# Altium schematic sheet Sheet1 (1).SchDoc
size A
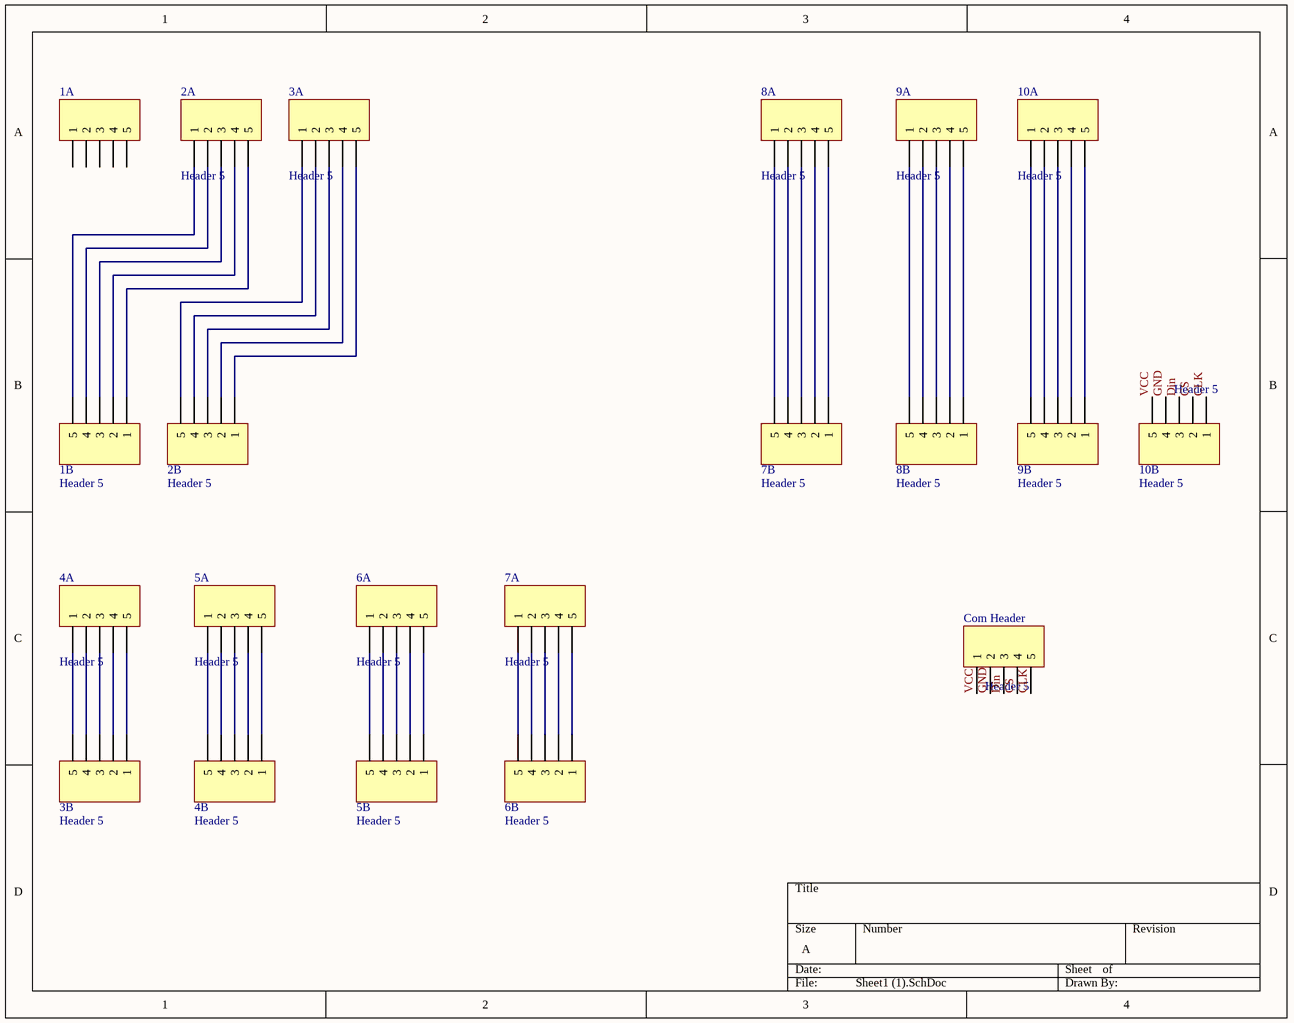
[diagram p0: Sheet1 (1).SchDoc]

## Parts
1A  Header 5  [HDR1X5]
1B  Header 5  [HDR1X5]
2A  Header 5  [HDR1X5]
2B  Header 5  [HDR1X5]
3A  Header 5  [HDR1X5]
3B  Header 5  [HDR1X5]
4A  Header 5  [HDR1X5]
4B  Header 5  [HDR1X5]
5A  Header 5  [HDR1X5]
5B  Header 5  [HDR1X5]
6A  Header 5  [HDR1X5]
6B  Header 5  [HDR1X5]
7A  Header 5  [HDR1X5]
7B  Header 5  [HDR1X5]
8A  Header 5  [HDR1X5]
8B  Header 5  [HDR1X5]
9A  Header 5  [HDR1X5]
9B  Header 5  [HDR1X5]
10A  Header 5  [HDR1X5]
10B  Header 5  [HDR1X5]
Com_Header  Header 5  [HDR1X5]

## Nets
CLK: 10B.1 Com_Header.5
CS: 10B.2 Com_Header.4
Din: 10B.3 Com_Header.3
GND: 10B.4 Com_Header.2
VCC: 10B.5 Com_Header.1
Net1B_1: 1B.1 2A.5
Net1B_2: 1B.2 2A.4
Net1B_3: 1B.3 2A.3
Net1B_4: 1B.4 2A.2
Net1B_5: 1B.5 2A.1
Net2B_1: 2B.1 3A.5
Net2B_2: 2B.2 3A.4
Net2B_3: 2B.3 3A.3
Net2B_4: 2B.4 3A.2
Net2B_5: 2B.5 3A.1
Net3B_1: 3B.1 4A.5
Net3B_2: 3B.2 4A.4
Net3B_3: 3B.3 4A.3
Net3B_4: 3B.4 4A.2
Net3B_5: 3B.5 4A.1
Net4B_1: 4B.1 5A.5
Net4B_2: 4B.2 5A.4
Net4B_3: 4B.3 5A.3
Net4B_4: 4B.4 5A.2
Net4B_5: 4B.5 5A.1
Net5B_1: 5B.1 6A.5
Net5B_2: 5B.2 6A.4
Net5B_3: 5B.3 6A.3
Net5B_4: 5B.4 6A.2
Net5B_5: 5B.5 6A.1
Net6B_1: 6B.1 7A.5
Net6B_2: 6B.2 7A.4
Net6B_3: 6B.3 7A.3
Net6B_4: 6B.4 7A.2
Net6B_5: 6B.5 7A.1
Net7B_1: 7B.1 8A.5
Net7B_2: 7B.2 8A.4
Net7B_3: 7B.3 8A.3
Net7B_4: 7B.4 8A.2
Net7B_5: 7B.5 8A.1
Net8B_1: 8B.1 9A.5
Net8B_2: 8B.2 9A.4
Net8B_3: 8B.3 9A.3
Net8B_4: 8B.4 9A.2
Net8B_5: 8B.5 9A.1
Net9B_1: 9B.1 10A.5
Net9B_2: 9B.2 10A.4
Net9B_3: 9B.3 10A.3
Net9B_4: 9B.4 10A.2
Net9B_5: 9B.5 10A.1

Not connected (* = marked no-connect by the designer): 1A 1 2 3 4 5

## Library data of the parts
1A 1B 2A 2B 3A 3B 4A 4B 5A 5B 6A 6B 7A 7B 8A 8B 9A 9B 10A 10B Com_Header = Header 5: Header, 5-Pin; LatestRevisionDate: 17-Jul-2002; LatestRevisionNote: Re-released for DXP Platform.; Publisher: Altium Limited